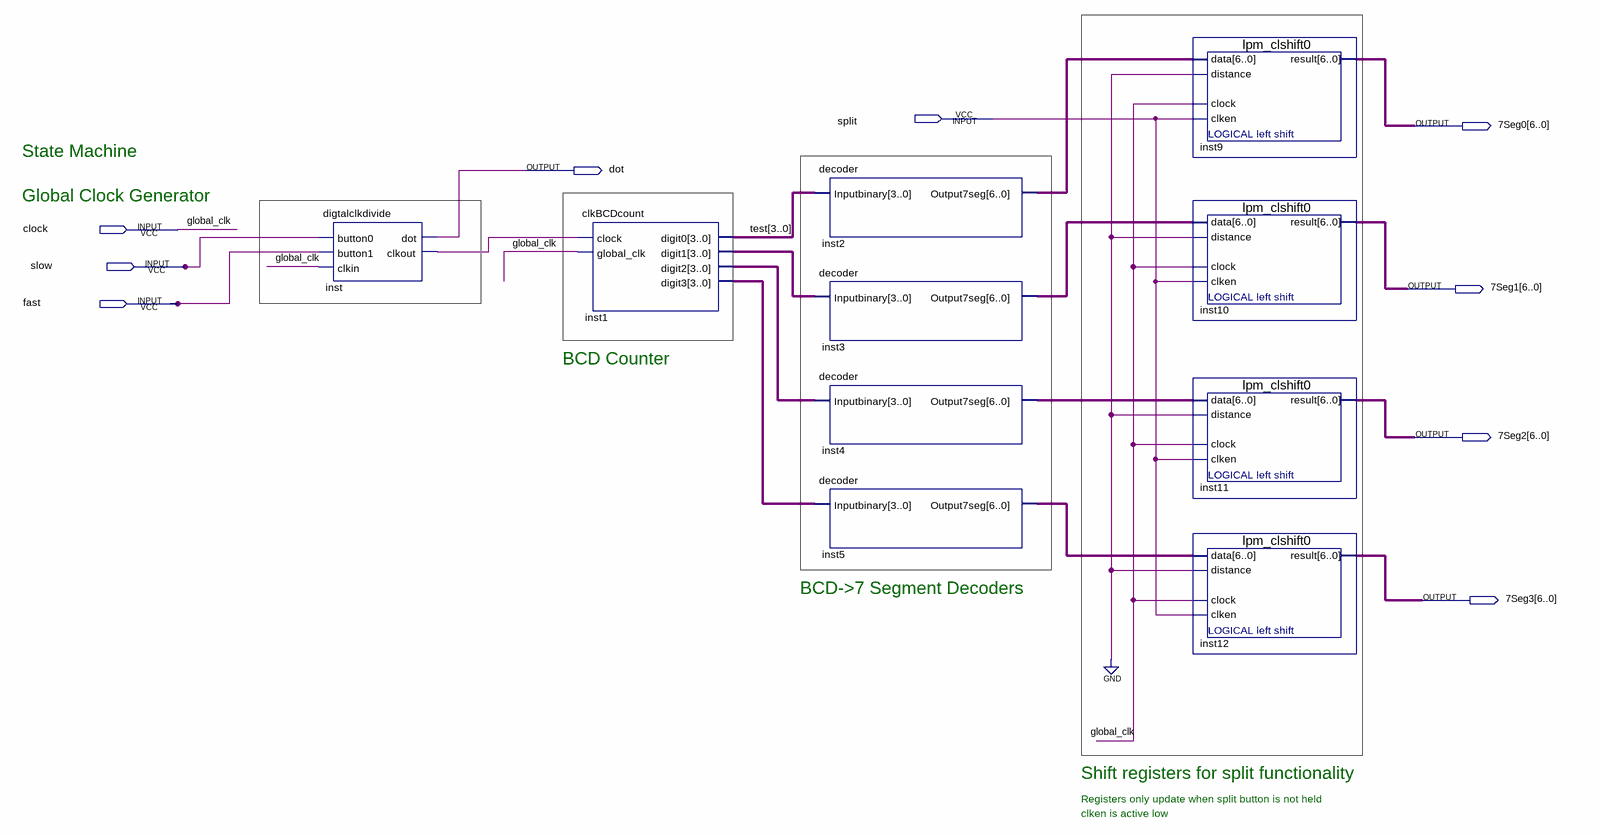
[diagram p0: schematic sheet]
// Quartus schematic digitalclock.bdf as structural Verilog: 10 symbols, 9 pins
module digitalclock (
  input  split,
  input  clock,
  input  slow,
  input  fast,
  output [6:0] \7Seg0 ,
  output dot,
  output [6:0] \7Seg1 ,
  output [6:0] \7Seg2 ,
  output [6:0] \7Seg3 
);

  wire inst_clkout;
  wire [3:0] inst1_digit1, inst1_digit2, inst1_digit3, test;
  wire [6:0] inst2_output7seg, inst3_output7seg, inst4_output7seg, inst5_output7seg;

  digtalclkdivide inst (.button0(slow), .button1(fast), .clkin(clock), .dot(dot), .clkout(inst_clkout));
  clkBCDcount inst1 (
    .clock(inst_clkout), .global_clk(clock), .digit0(test), .digit1(inst1_digit1), .digit2(inst1_digit2),
    .digit3(inst1_digit3));
  decoder inst2 (.Inputbinary(test), .Output7seg(inst2_output7seg));
  decoder inst3 (.Inputbinary(inst1_digit1), .Output7seg(inst3_output7seg));
  decoder inst4 (.Inputbinary(inst1_digit2), .Output7seg(inst4_output7seg));
  decoder inst5 (.Inputbinary(inst1_digit3), .Output7seg(inst5_output7seg));
  lpm_clshift0 inst9 (.data(inst2_output7seg), .distance(1'b0), .clock(clock), .clken(split), .result(\7Seg0 ));
  lpm_clshift0 inst10 (.data(inst3_output7seg), .distance(1'b0), .clock(clock), .clken(split), .result(\7Seg1 ));
  lpm_clshift0 inst11 (.data(inst4_output7seg), .distance(1'b0), .clock(clock), .clken(split), .result(\7Seg2 ));
  lpm_clshift0 inst12 (.data(inst5_output7seg), .distance(1'b0), .clock(clock), .clken(split), .result(\7Seg3 ));

  // Other names for the same wires on the sheet: global_clk = clock

  // Notes on the sheet:
  //   State Machine
  //   Global Clock Generator
  //   BCD Counter
  //   BCD->7 Segment Decoders
  //   Shift registers for split functionality
  //   Registers only update when split button is not held
  //   clken is active low
endmodule
